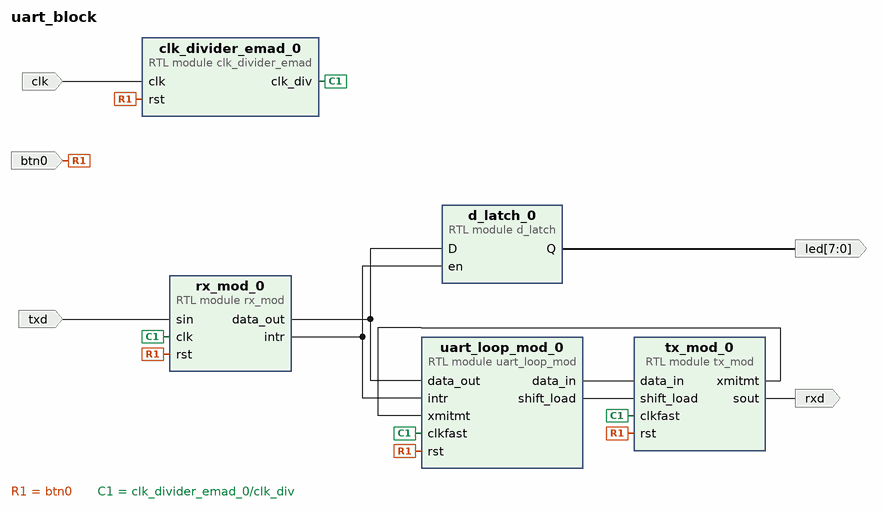
[diagram p0: block diagram of the top level]
# Vivado block design uart_block, xc7z020clg400-1, Vivado 2023.2.2
create_bd_design uart_block

create_bd_port -dir I -type clk clk
set_property -dict {CONFIG.FREQ_HZ 100000000} [get_bd_ports clk]
create_bd_port -dir I -type rst btn0
create_bd_port -dir I txd
create_bd_port -dir O -from 7 -to 0 led
create_bd_port -dir O rxd

create_bd_cell -type module -reference rx_mod rx_mod_0
create_bd_cell -type module -reference clk_divider_emad clk_divider_emad_0
create_bd_cell -type module -reference d_latch d_latch_0
create_bd_cell -type module -reference uart_loop_mod uart_loop_mod_0
create_bd_cell -type module -reference tx_mod tx_mod_0

# ---- connections ----

connect_bd_net -net btn0_1 [get_bd_ports btn0] \
  [get_bd_pins rx_mod_0/rst] [get_bd_pins uart_loop_mod_0/rst] [get_bd_pins tx_mod_0/rst] \
  [get_bd_pins clk_divider_emad_0/rst]
connect_bd_net [get_bd_ports clk] [get_bd_pins clk_divider_emad_0/clk]
connect_bd_net [get_bd_pins clk_divider_emad_0/clk_div] \
  [get_bd_pins rx_mod_0/clk] [get_bd_pins uart_loop_mod_0/clkfast] [get_bd_pins tx_mod_0/clkfast]
connect_bd_net [get_bd_pins d_latch_0/Q] [get_bd_ports led]
connect_bd_net [get_bd_pins rx_mod_0/data_out] [get_bd_pins d_latch_0/D] [get_bd_pins uart_loop_mod_0/data_out]
connect_bd_net [get_bd_pins rx_mod_0/intr] [get_bd_pins uart_loop_mod_0/intr] [get_bd_pins d_latch_0/en]
connect_bd_net -net sin_1 [get_bd_ports txd] [get_bd_pins rx_mod_0/sin]
connect_bd_net [get_bd_pins tx_mod_0/sout] [get_bd_ports rxd]
connect_bd_net [get_bd_pins tx_mod_0/xmitmt] [get_bd_pins uart_loop_mod_0/xmitmt]
connect_bd_net [get_bd_pins uart_loop_mod_0/data_in] [get_bd_pins tx_mod_0/data_in]
connect_bd_net [get_bd_pins uart_loop_mod_0/shift_load] [get_bd_pins tx_mod_0/shift_load]

validate_bd_design
save_bd_design
